# EAGLE schematic si4844 (EAGLE 7.5.0)
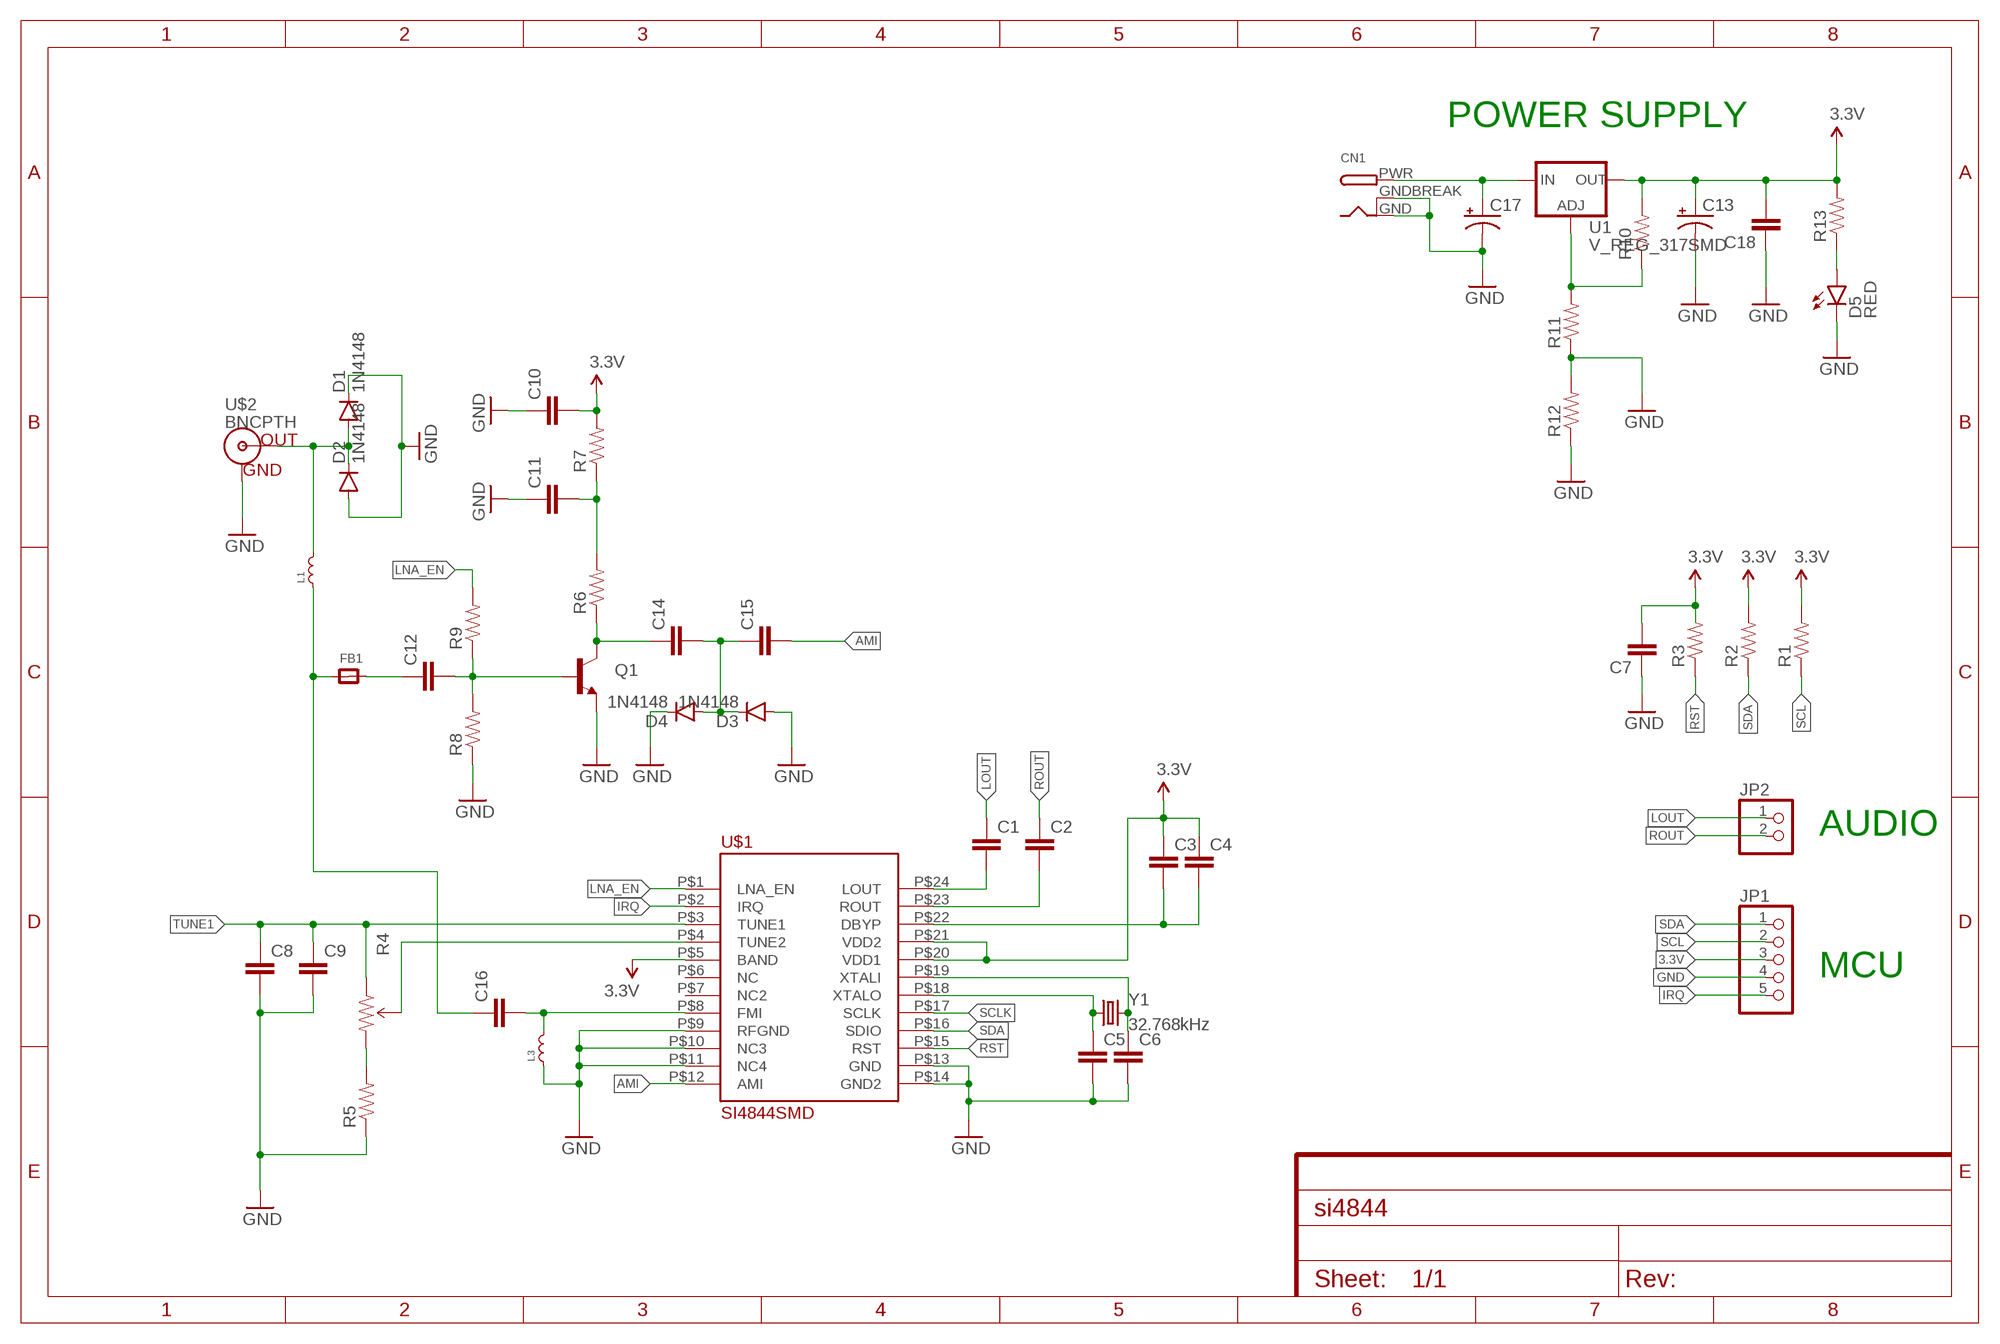
[diagram p0: schematic, sheet 1]

## Parts
C1  CAP0603-CAP  [0603-CAP]
C2  CAP0603-CAP  [0603-CAP]
C3  CAP0603-CAP  [0603-CAP]
C4  CAP0603-CAP  [0603-CAP]
C5  CAP0603-CAP  [0603-CAP]
C6  CAP0603-CAP  [0603-CAP]
C7  CAP0603-CAP  [0603-CAP]
C8  CAP0603-CAP  [0603-CAP]
C9  CAP0603-CAP  [0603-CAP]
C10  CAP0603-CAP  [0603-CAP]
C11  CAP0603-CAP  [0603-CAP]
C12  CAP0603-CAP  [0603-CAP]
C13  CAP_POL1206-KIT  [EIA3216-KIT]
C14  CAP0603-CAP  [0603-CAP]
C15  CAP0603-CAP  [0603-CAP]
C16  CAP0603-CAP  [0603-CAP]
C17  CAP_POL1206-KIT  [EIA3216-KIT]
C18  CAP0603-CAP  [0603-CAP]
CN1  DCBARRELPTH  [DCJACK_2MM_PTH]
D1  1N4148  DIODE1N4148  [DIODE-1N4148]
D2  1N4148  DIODE1N4148  [DIODE-1N4148]
D3  1N4148  DIODE1N4148  [DIODE-1N4148]
D4  1N4148  DIODE1N4148  [DIODE-1N4148]
D5  RED  LED-RED1206  [LED-1206]
FB1  FERRITE_0603  [_0603]
JP1  HEADER-1X5  [1X05_OVAL]
JP2  HEADER-1X2  [1X02_OVAL]
L1  RF-INDUCTOR.0603  [0603]
L3  RF-INDUCTOR.0603  [0603]
Q1  TRANSISTOR_NPNBC547  [TO-92-AMMO]
R1  RESISTOR0603-RES  [0603-RES]
R2  RESISTOR0603-RES  [0603-RES]
R3  RESISTOR0603-RES  [0603-RES]
R4  TRIMPOT3362U-2  [3362U-2]
R5  RESISTOR0603-RES  [0603-RES]
R6  RESISTOR0603-RES  [0603-RES]
R7  RESISTOR0603-RES  [0603-RES]
R8  RESISTOR0603-RES  [0603-RES]
R9  RESISTOR0603-RES  [0603-RES]
R10  RESISTOR0603-RES  [0603-RES]
R11  RESISTOR0603-RES  [0603-RES]
R12  RESISTOR0603-RES  [0603-RES]
R13  RESISTOR0603-RES  [0603-RES]
U1  V_REG_317SMD  [SOT223]
U$1  SI4844SMD  [SSOP24]
U$2  BNCPTH  [BNC]
Y1  32.768kHz  CRYSTAL3.2X1.5MM  [CRYSTAL-SMD-3.2X1.5MM]

## Nets
3.3V: C3.1 C4.1 C7.2 C10.2 C13.A(+) C18.2 JP1.3 R1.2 R2.2 R3.2 R7.2 R10.2 R13.2 U1.2(OUT) U$1.P$5(BAND) U$1.P$20(VDD1) U$1.P$21(VDD2)
AMI: C15.2 U$1.P$12(AMI)
FMI: C16.1 FB1.1 L1.1
GND: C5.2 C6.2 C7.1 C8.2 C9.2 C10.1 C11.1 C13.C(-) C17.C(-) C18.1 CN1.GND CN1.GNDBREAK D1.C D2.A D3.A D4.C D5.C JP1.4 L3.1 Q1.3(E) R5.1 R8.1 R11.1 R12.1 R12.2 U$1.P$9(RFGND) U$1.P$10(NC3) U$1.P$11(NC4) U$1.P$13(GND) U$1.P$14(GND2) U$2.GND
IRQ: JP1.5 U$1.P$2(IRQ)
LNA_EN: R9.2 U$1.P$1(LNA_EN)
LOUT: C1.1 JP2.1
N$1: C1.2 U$1.P$24(LOUT)
N$2: C2.2 U$1.P$23(ROUT)
N$3: C3.2 C4.2 U$1.P$22(DBYP)
N$4: C5.1 U$1.P$18(XTALO) Y1.P$1
N$5: C11.2 R6.2 R7.1
N$6: R4.2(WIPER) U$1.P$4(TUNE2)
N$7: C12.2 Q1.2(B) R8.2 R9.1
N$8: C6.1 U$1.P$19(XTALI) Y1.P$2
N$9: C14.1 Q1.1(C) R6.1
N$10: R4.3(CW) R5.2
N$11: C14.2 C15.1 D3.C D4.A
N$12: C12.1 FB1.2
N$13: D1.A D2.C L1.2 U$2.S(OUT)
N$14: C17.A(+) CN1.PWR U1.3(IN)
N$16: C16.2 L3.2 U$1.P$8(FMI)
N$17: R10.1 R11.2 U1.1(ADJ)
N$18: D5.A R13.1
ROUT: C2.1 JP2.2
RST: R3.1 U$1.P$15(RST)
SCL: JP1.2 R1.1
SCLK: U$1.P$17(SCLK)
SDA: JP1.1 R2.1 U$1.P$16(SDIO)
TUNE1: C8.1 C9.1 R4.1(CCW) U$1.P$3(TUNE1)
Unconnected: U$1.P$6(NC) U$1.P$7(NC2)

## Notes on the sheet
- POWER SUPPLY
- AUDIO
- MCU

## Library data of the parts
C1-C12 C14-C16 C18 = SparkFun-Capacitors:CAP: Capacitor Standard 0603 ceramic capacitor, and 0.1" leaded capacitor.
C13 C17 = SparkFun-Passives:CAP_POL: Capacitor Polarized These are standard SMD and PTH capacitors. Normally 10uF, 47uF, and 100uF in electrolytic and tantalum varieties. Always verify the external diameter of the through hole cap, it varies with capacity, voltage, and manufacturer. The EIA devices should be standard.
CN1 = adafruit:DCBARREL: 2.0mm DC Barrel Jack DCJACK_2MM_PTH - Through Hole Jack (4UConnector: 05537)
D1-D4 = SparkFun-DiscreteSemi:DIODE: Diode These are standard reverse protection diodes and small signal diodes. SMA package can handle up to about 1A. SOD-323 can handle about 200mA. What the SOD-323 package when ordering, there are some mfgs out there that are 5-pin packages.; PROD_ID: DIO-08378
D5 = SparkFun-LED:LED-RED: Assorted Red LEDs LilyPad 1206- DIO-09912 1206- DIO-00809 0603- DIO-00819 "SMART" means more efficient and expensive; PROD_ID: DIO-09912
FB1 = microbuilder:FERRITE: Ferrite Bead 0603 MMZ1608B121C - 120 Ohm @ 100MHz, 600mA, 0.15 Ohm DC Resistance - Digikey: 445-2164-1-ND BK1608HW121-T - 120 Ohm, 600mA Ferrite Chip - Digikey: 587-1876-2-ND 0805 HZ0805B272R-10 - 2.7K Ohm @ 100MHz, 200mA, 0.8 Ohm DC Resistance - Digikey: 240-2504-1-ND (see also Murata BLM21BD272SN1L) MMZ2012Y152B - 1.5K Ohm @ 100MHz, 500mA, 0.4 Ohm DC Resistance - Digikey: 445-1560-1-ND - Mainly for high frequency (80-400MHz) MMZ2012R102A - 1K Ohm @ 100MHz, 500mA, 0.3 Ohm DC Resistance - Digikey: 445-1555-2-ND - More general purpose (10-200MHz)
JP1 = microbuilder:HEADER-1X5: PIN HEADER
JP2 = microbuilder:HEADER-1X2: PIN HEADER
L1 L3 = standardparts:RF-INDUCTOR
Q1 = SparkFun-DiscreteSemi:TRANSISTOR_NPN: Generic NPN BJT MMBT2222A - TRANS-08049 (SOT-23, 1A 40V) MPSA42 - TRANS-09116 (SOT-23, 500mA 300V) MMBT5088LT1G - TRANS-11160 (SOT-23, 50 mA 30V) BC547 - COM-08928 <http://www.sparkfun.com/products/8928> (TO-92 45V 100mA) (1.Collector 2.Base 3.Emitter) 2N3904 - COM-00521 <http://www.sparkfun.com/products/521> (TO-92 40V 200mA) (1.Emitter 2.Base 3.Collector) P2N2222A - COM-12852 <http://www.sparkfun.com/products/12852> (TO-92 40V 600mA) (1.Collector 2.Base 3.Emitter)
R1-R3 R5-R13 = SparkFun-Passives:RESISTOR: Resistor Basic schematic elements and footprints for 0603, 1206, and PTH resistors.
R4 = SparkFun-Electromechanical:TRIMPOT: Various small potentiometers for "set-and-forget" applications
U1 = SparkFun-PowerIC:V_REG_317: Voltage Regulator Standard LM317 adjustable voltage regulator. AOI (Adjust Output Input). Google 'LM317 Calculator' for easy to use app to get the two resistor values needed. 240/720 for 5V output. 240/390 for 3.3V output. Spark Fun Electronics SKU : COM-00527
U$1 = radio:SI4844
U$2 = SparkFun-Connectors:BNC: BNC Connector, Mouser Part# 5227161
Y1 = SparkFun-FreqCtrl:CRYSTAL: Various standard crystals. Proven footprints.; PROD_ID: XTAL-13062